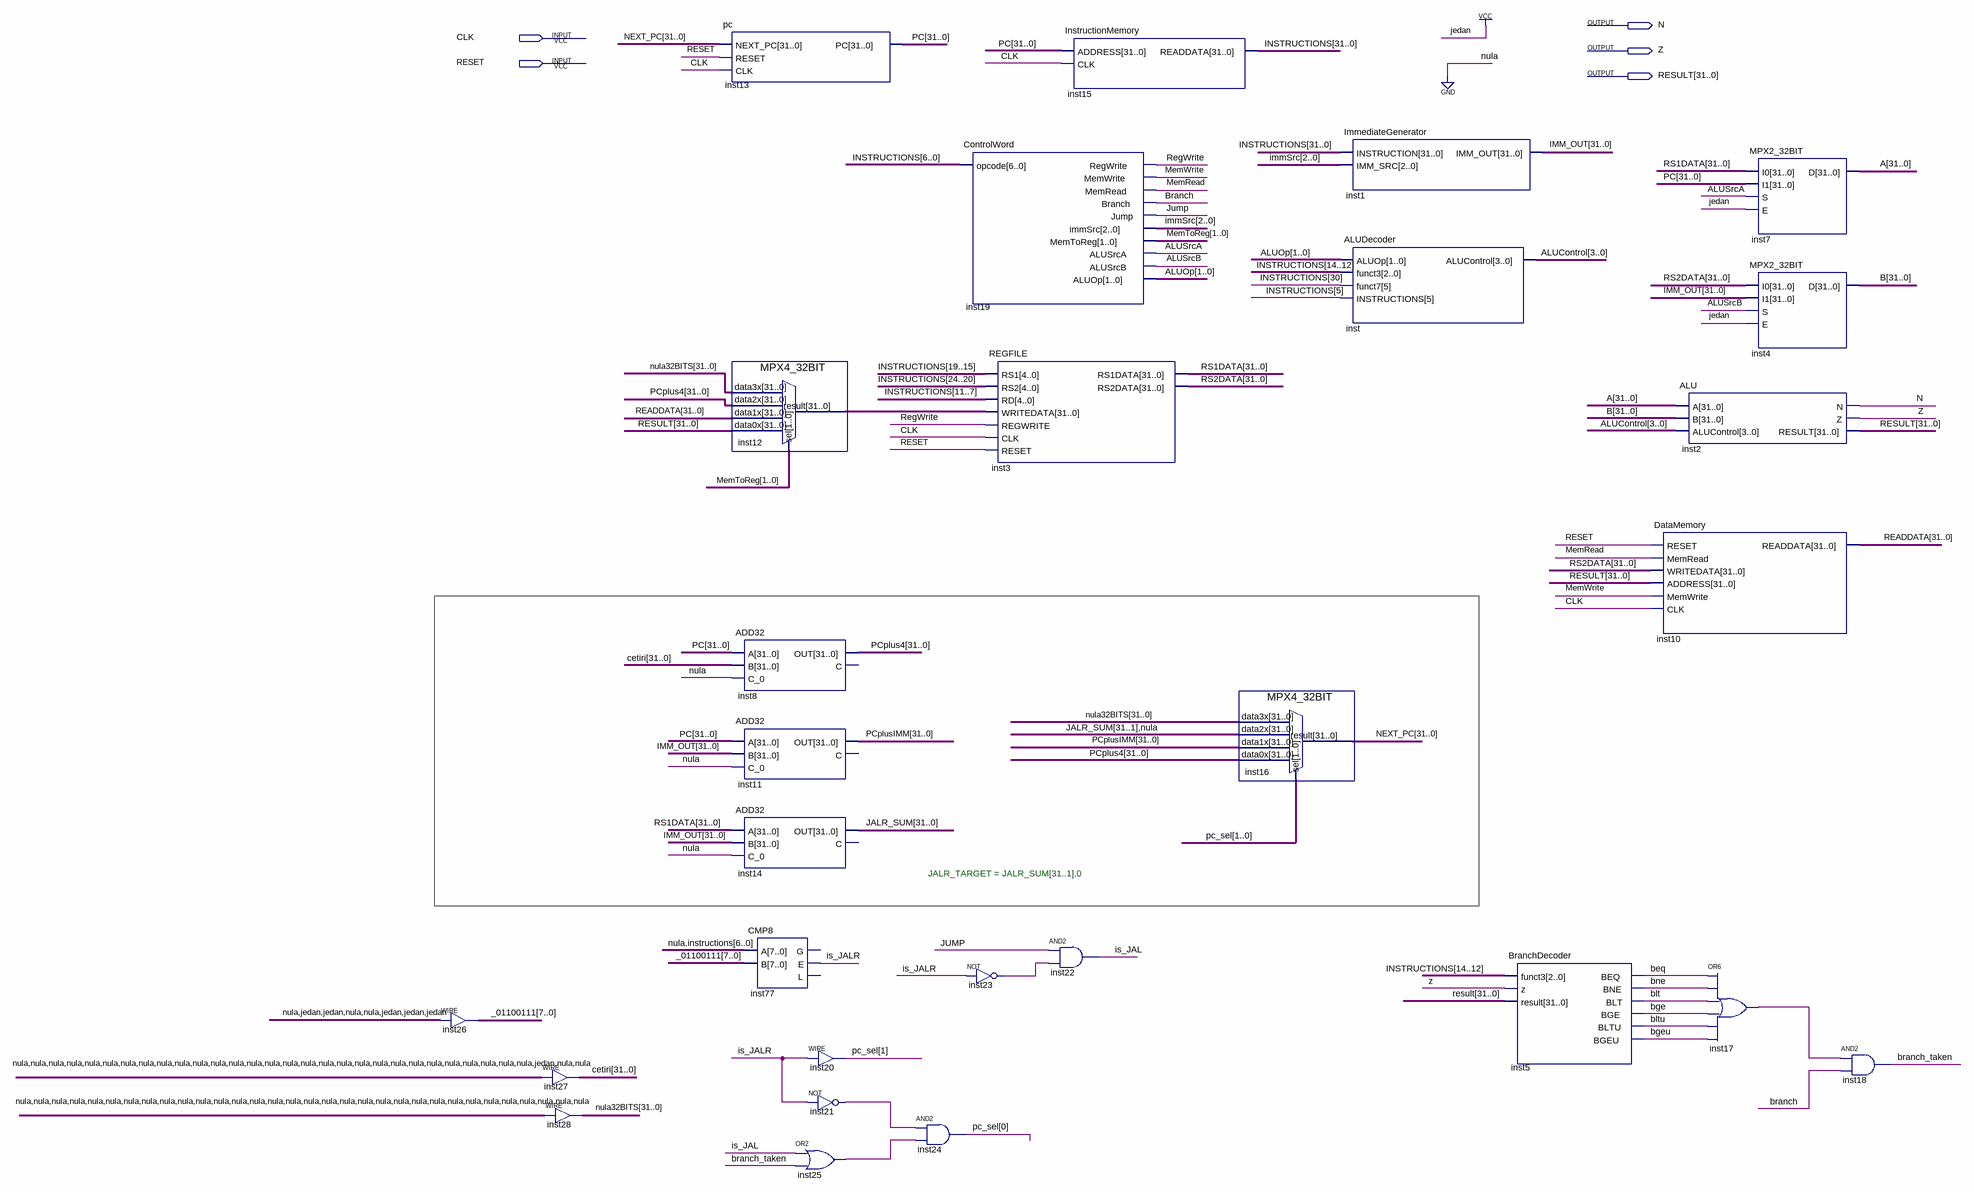
[diagram p0: schematic sheet]
// Quartus schematic Riscv32i.bdf as structural Verilog: 28 symbols, 5 pins
module Riscv32i (
  input  CLK,
  input  RESET,
  output N,
  output Z,
  output [31:0] RESULT
);

  wire ALUSrcA, ALUSrcB, beq, bge, bgeu, blt, bltu, bne, Branch, branch_taken, inst17_out, inst21_out,
       inst23_out, inst25_out, is_JAL, is_JALR, Jump, MemRead, MemWrite, RegWrite;
  wire [1:0] ALUOp, MemToReg, pc_sel;
  wire [2:0] immSrc;
  wire [3:0] ALUControl;
  wire [7:0] _01100111;
  wire [31:0] A, B, cetiri, IMM_OUT, inst12_result, INSTRUCTIONS, JALR_SUM, NEXT_PC, nula32BITS, PC, PCplus4,
       PCplusIMM, READDATA, RS1DATA, RS2DATA;

  assign _01100111 = 8'b01100111;  // WIRE inst26
  assign cetiri = 32'b00000000000000000000000000000100;  // WIRE inst27
  assign nula32BITS = {32{1'b0}};  // WIRE inst28
  pc inst13 (.NEXT_PC(NEXT_PC), .RESET(RESET), .CLK(CLK), .PC(PC));
  MPX4_32BIT inst12 (
    .data3x(nula32BITS), .data2x(PCplus4), .data1x(READDATA), .data0x(RESULT), .sel(MemToReg),
    .result(inst12_result));
  ADD32 inst8 (.A(PC), .B(cetiri), .C_0(1'b0), .OUT(PCplus4));  // open: C
  ADD32 inst11 (.A(PC), .B(IMM_OUT), .C_0(1'b0), .OUT(PCplusIMM));  // open: C
  ADD32 inst14 (.A(RS1DATA), .B(IMM_OUT), .C_0(1'b0), .OUT(JALR_SUM));  // open: C
  CMP8 inst77 (.A({1'b0, INSTRUCTIONS[6:0]}), .B(_01100111), .E(is_JALR));  // open: G, L
  or inst25 (inst25_out, is_JAL, branch_taken);
  assign pc_sel[1] = is_JALR;  // WIRE inst20
  not inst21 (inst21_out, is_JALR);
  and inst24 (pc_sel[0], inst21_out, inst25_out);
  ControlWord inst19 (
    .opcode(INSTRUCTIONS[6:0]), .RegWrite(RegWrite), .MemWrite(MemWrite), .MemRead(MemRead), .Branch(Branch),
    .Jump(Jump), .immSrc(immSrc), .MemToReg(MemToReg), .ALUSrcA(ALUSrcA), .ALUSrcB(ALUSrcB), .ALUOp(ALUOp));
  REGFILE inst3 (
    .RS1(INSTRUCTIONS[19:15]), .RS2(INSTRUCTIONS[24:20]), .RD(INSTRUCTIONS[11:7]), .WRITEDATA(inst12_result),
    .REGWRITE(RegWrite), .CLK(CLK), .RESET(RESET), .RS1DATA(RS1DATA), .RS2DATA(RS2DATA));
  not inst23 (inst23_out, is_JALR);
  and inst22 (is_JAL, Jump, inst23_out);
  InstructionMemory inst15 (.ADDRESS(PC), .CLK(CLK), .READDATA(INSTRUCTIONS));
  MPX4_32BIT inst16 (
    .data3x(nula32BITS), .data2x({JALR_SUM[31:1], 1'b0}), .data1x(PCplusIMM), .data0x(PCplus4), .sel(pc_sel),
    .result(NEXT_PC));
  ImmediateGenerator inst1 (.INSTRUCTION(INSTRUCTIONS), .IMM_SRC(immSrc), .IMM_OUT(IMM_OUT));
  ALUDecoder inst (
    .ALUOp(ALUOp), .funct3(INSTRUCTIONS[14:12]), .funct7(INSTRUCTIONS[30]), .INSTRUCTIONS(INSTRUCTIONS[5]),
    .ALUControl(ALUControl));
  BranchDecoder inst5 (
    .funct3(INSTRUCTIONS[14:12]), .z(Z), .result(RESULT), .BEQ(beq), .BNE(bne), .BLT(blt), .BGE(bge),
    .BLTU(bltu), .BGEU(bgeu));
  DataMemory inst10 (
    .RESET(RESET), .MemRead(MemRead), .WRITEDATA(RS2DATA), .ADDRESS(RESULT), .MemWrite(MemWrite), .CLK(CLK),
    .READDATA(READDATA));
  ALU inst2 (.A(A), .B(B), .ALUControl(ALUControl), .N(N), .Z(Z), .RESULT(RESULT));
  or inst17 (inst17_out, beq, bne, blt, bge, bltu, bgeu);
  MPX2_32BIT inst7 (.I0(RS1DATA), .I1(PC), .S(ALUSrcA), .E(1'b1), .D(A));
  MPX2_32BIT inst4 (.I0(RS2DATA), .I1(IMM_OUT), .S(ALUSrcB), .E(1'b1), .D(B));
  and inst18 (branch_taken, inst17_out, Branch);

  // Notes on the sheet:
  //   JALR_TARGET = JALR_SUM[31..1],0
endmodule
